# Altium schematic sheet THP_Sensor.SchDoc
size A; SheetNumber: 9; SheetTotal: 10
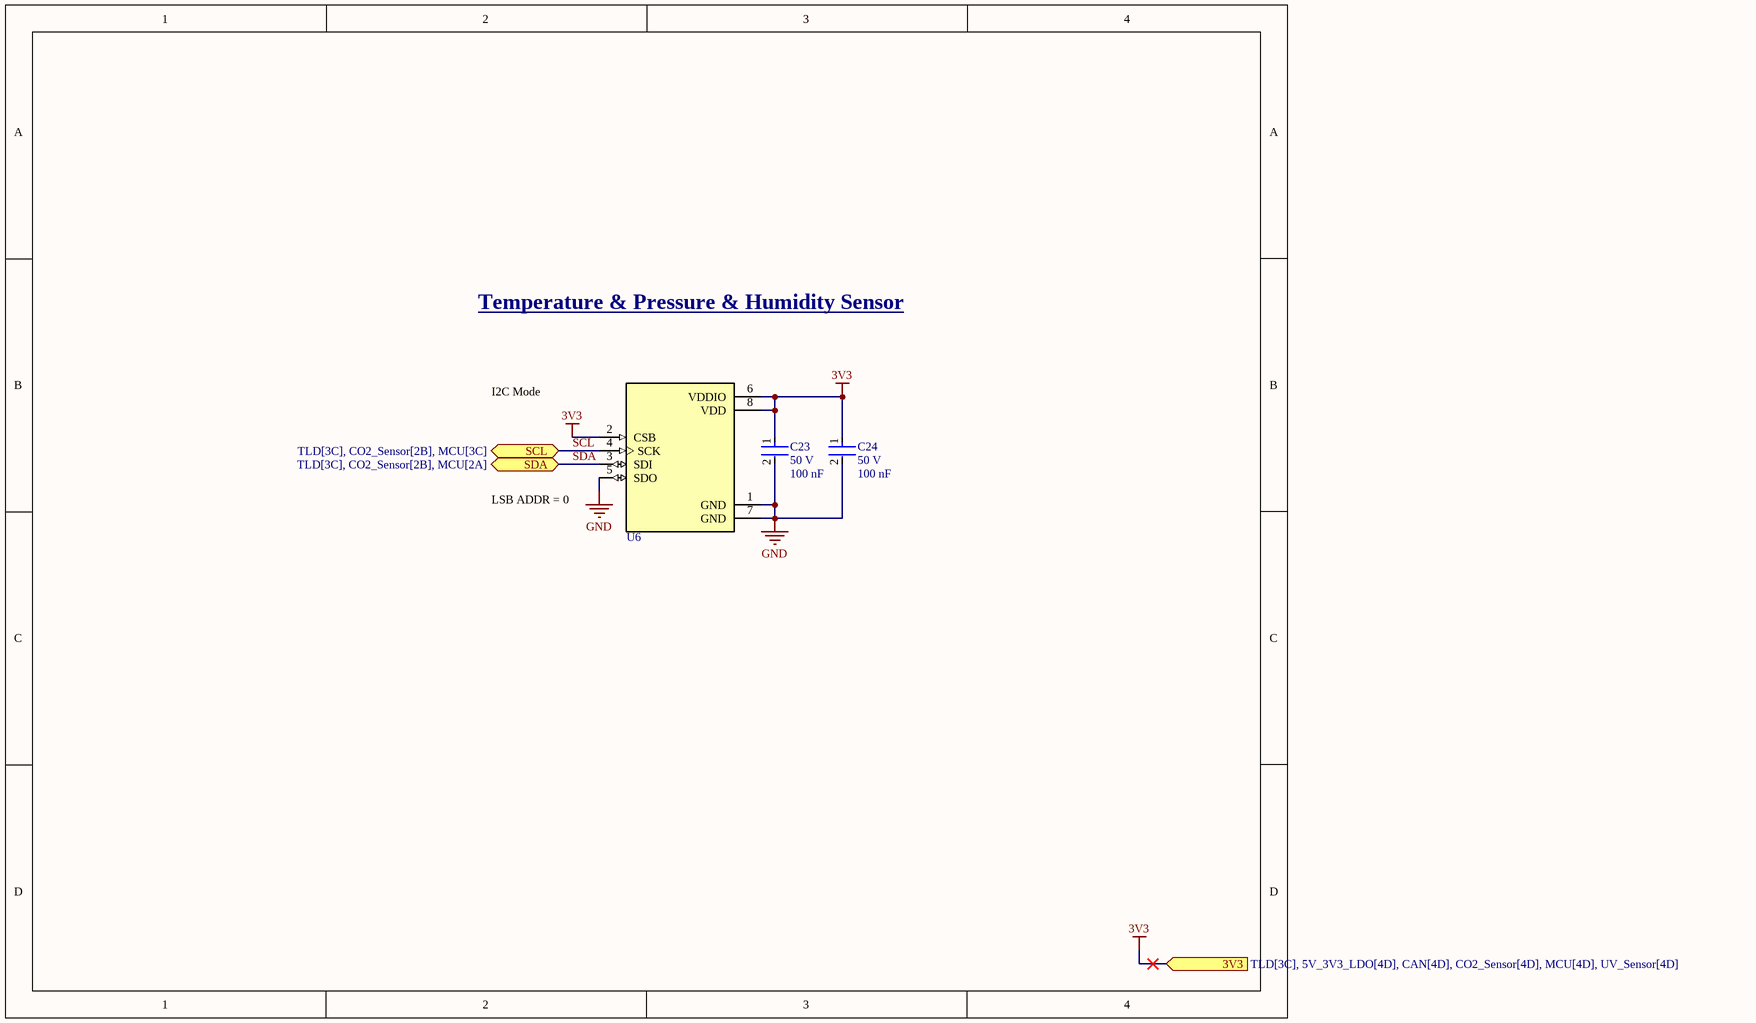
[diagram p0: THP_Sensor.SchDoc]

## Parts
C23  Voltage Rating: 50 V  Capacitance: 100 nF  [CAP-0805]  (hidden comment: CC0805KRX7R9BB104)
C24  Voltage Rating: 50 V  Capacitance: 100 nF  [CAP-0805]  (hidden comment: CC0805KRX7R9BB104)
U6  BME280  [PSON65P250X250X100-8N]  (value not drawn)

## Ports
3V3 (in, see TLD[3C], 5V_3V3_LDO[4D], CAN[4D], CO2_Sensor[4D], MCU[4D], UV_Sensor[4D]), SCL (bidir, see TLD[3C], CO2_Sensor[2B], MCU[3C]), SDA (bidir, see TLD[3C], CO2_Sensor[2B], MCU[2A])

## Nets
3V3: C23.1 C24.1 U6.2(CSB) U6.6(VDDIO) U6.8(VDD) ; port 3V3
GND: C23.2 C24.2 U6.1(GND) U6.5(SDO) U6.7(GND)
SCL: U6.4(SCK) ; port SCL
SDA: U6.3(SDI) ; port SDA

## Notes on the sheet
- Temperature & Pressure & Humidity Sensor
- (near U6) I2C Mode
- (near U6) LSB ADDR = 0

## Library data of the parts
C23 C24 = CAP-0.1U-0002: CAP CER 0.1UF 50V X7R 0805; ComponentLink2Description: Datasheet; ComponentLink2URL: https://www.yageo.com/upload/media/product/productsearch/datasheet/mlcc/UPY-GPHC_X7R_6.3V-to-250V_24.pdf; Device Class: Ceramic; Size: 0805
U6 = SENS-Temp-Press-Humid: DIGITAL HUMIDITY, PRESSURE AND TEMPERATURE SENSOR<br>* Digital interface IÂ²C (up to 3.4 MHz) and SPI (3 and 4 wire, up to 10 MHz)* Supply voltage VDD main supply voltage range: 1.71 V to 3.6 V*VDDIO interface voltage range: 1.2 V to 3.6 V<br> Operating range -40â€¦+85 Â°C, 0â€¦100 % rel. humidity, 300â€¦1100 hPa <br><br>  The library has been designed by<a href="https://www.facebook.com/groups/eaglecadsoftUK"> Richard Magdycz</a>; Package: None; Availability: Unavailable; MP: BME280; Value: *; Price: None; ComponentLink1Description: Datasheet; ComponentLink1URL: https://www.bosch-sensortec.com/media/boschsensortec/downloads/datasheets/bst-bme280-ds002.pdf